# EasyEDA Pro project STM32空调遥控器.eprj, board PCB_V1.0.0
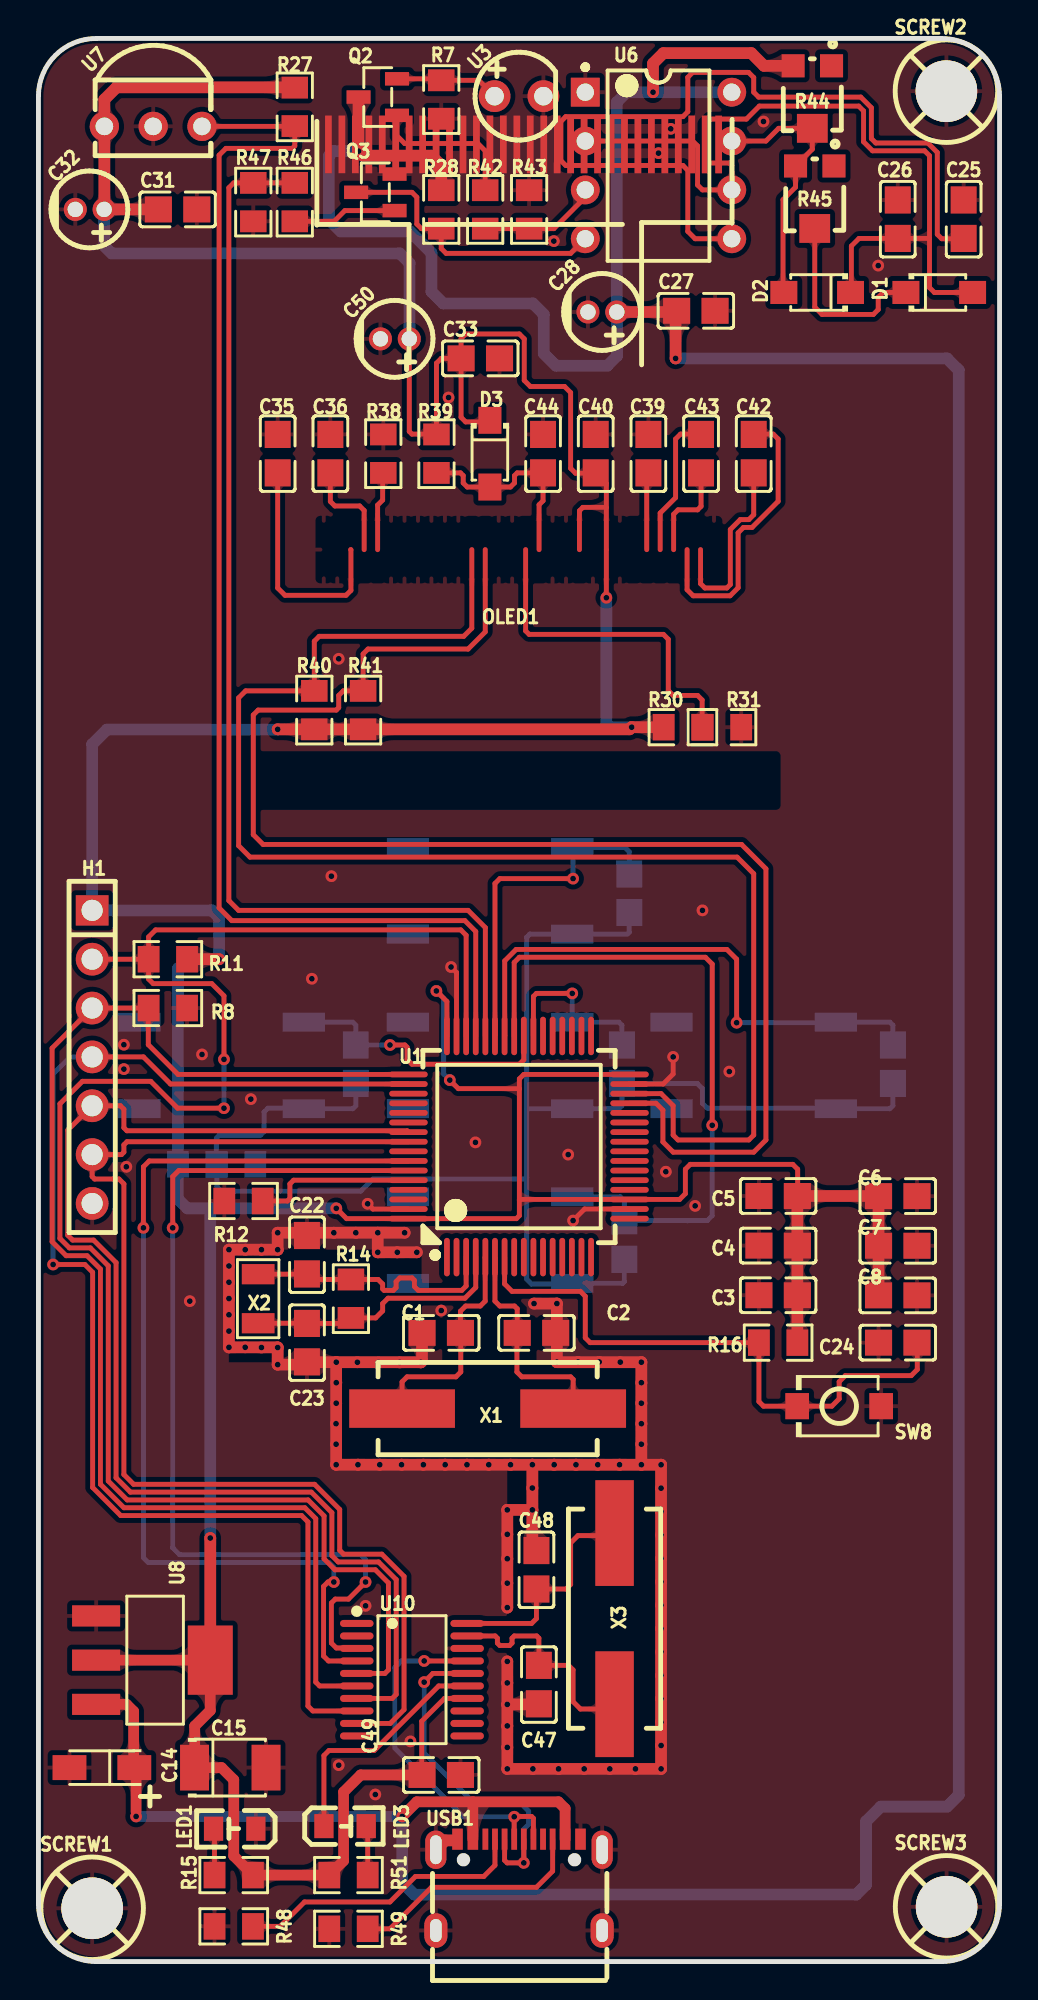
[diagram p7: board, top side]
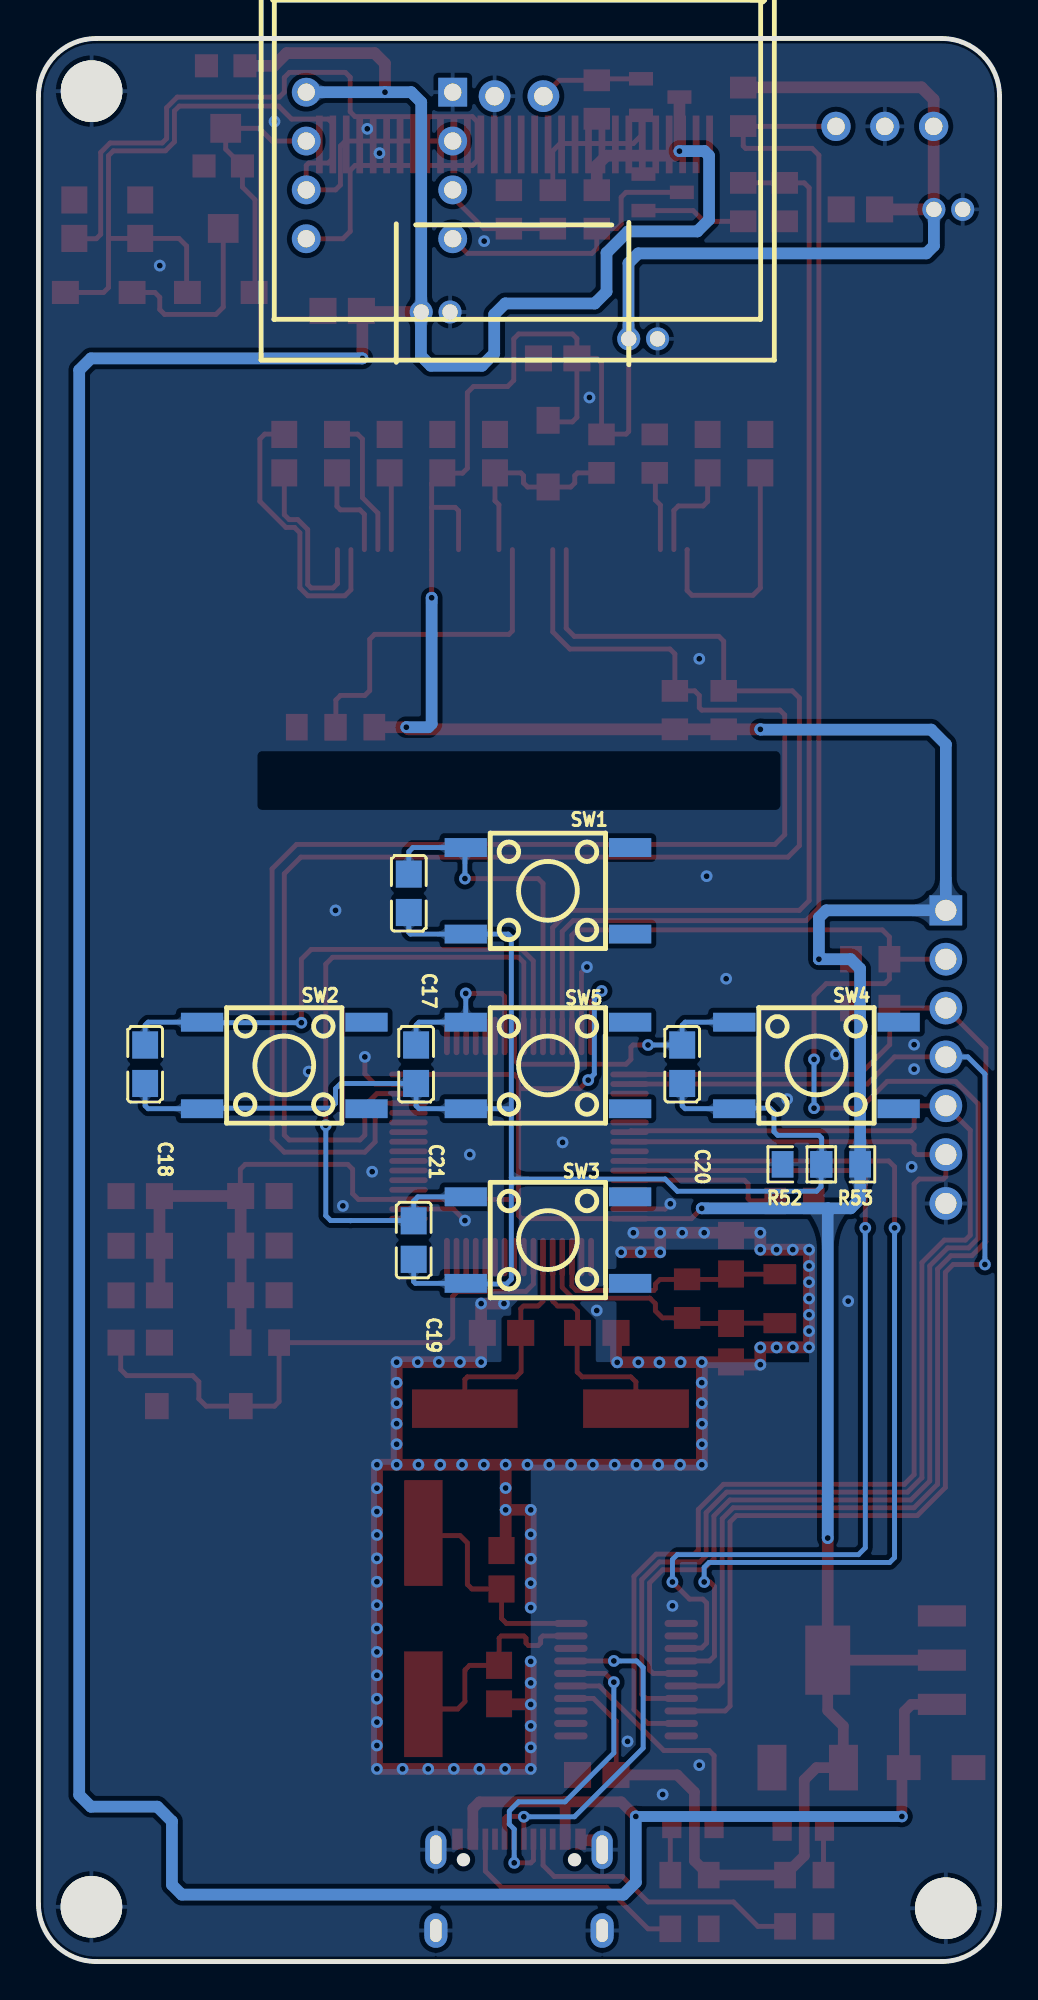
[diagram p8: board, bottom side, seen from below]

Outline 50 x 100 mm; copper layers: Top Layer, Bottom Layer. Coordinates in mm from the lower left corner of the outline.
Outline path: 0,97 0,3 arc(0.88,0.88) 3,0 47,0 arc(49.12,0.88) 50,3 50,97 arc(49.12,99.12) 47,100 3,100 arc(0.88,99.12) 0,97
Stack: Top Layer 0.035mm / Dielectric1 1.51mm FR4 er 4.5 / Bottom Layer 0.035mm

## Design rules (mm)
net OSC_IN: osc
net OSC_OUT: osc
net OSC32_IN: 32osc
net OSC32_OUT: 32osc
net XO: 347osc
net D+: usb
net D-: usb
net XI: 347osc
template: 自定义配置
spacing copperThickness1oz (default): track to track 0.152, other pairs 0.152 to 0.3
spacing copperThickness2oz: track to track 0.254, other pairs 0.152 to 0.3
track width copperThickness1oz (default): min 0.254, default 0.381, max 2.54
track width copperThickness2oz: min 0.203, default 0.254, max 2.54
differential pair differentialPair (default): width min 0.127, default 0.254, max 2.54; gap min 0.152, default 0.152
via viaSize (default): diameter min 0.5, default 0.61, max 10; hole min 0.3, default 0.305, max 6.299

## Placement (name value [footprint] x y rotation side)
C1  20pF  [C0805]  20.96 32.69 0 top
C2  20pF  [C0805]  25.91 32.69 180 top
C3  100nF  [C0805]  38.48 34.65 0 top
C4  100nF  [C0805]  38.48 37.23 0 top
C5  100nF  [C0805]  38.48 39.81 0 top
C6  100nF  [C0805]  44.7 39.8 180 top
C7  100nF  [C0805]  44.7 37.22 180 top
C8  4.7uF  [C0805]  44.7 34.64 180 top
C14  10uF  [CAP-SMD_L3.2-W1.6-RD-C7171]  3.3 10.08 180 top
C15  22uF  [CASE-B_3528]  9.98 10.08 0 top
C17  100uF  [C0805]  30.73 55.55 90 bottom
C18  100uF  [C0805]  44.45 46.66 90 bottom
C19  100uF  [C0805]  30.48 37.52 90 bottom
C20  100uF  [C0805]  16.51 46.66 90 bottom
C21  100uF  [C0805]  30.35 46.66 90 bottom
C22  12.5pF  [C0805]  13.97 36.75 270 top
C23  12.5pF  [C0805]  13.97 32.18 90 top
C24  100nF  [C0805]  44.7 32.18 0 top
C25  0.01μF  [C0805]  48.13 90.6 270 top
C26  10nF  [C0805]  44.7 90.6 270 top
C27  100nF  [C0805]  34.2 85.84 0 top
C28  10uF  [CAP-TH_BD4.0-P1.50-D0.8-FD]  29.34 85.78 180 top
C31  100nF  [C0805]  7.24 91.11 0 top
C32  10uF  [CAP-TH_BD4.0-P1.50-D0.8-FD]  2.67 91.11 180 top
C33  100nF  [C0805]  22.99 83.36 0 top
C35  2.2uF  [C0805]  12.45 78.41 270 top
C36  2.2uF  [C0805]  15.19 78.41 270 top
C39  1uF  [C0805]  31.73 78.41 270 top
C40  1uF  [C0805]  28.99 78.41 270 top
C42  10uF  [C0805]  37.21 78.41 270 top
C43  10uF  [C0805]  34.47 78.41 270 top
C44  100nF  [C0805]  26.25 78.41 270 top
C47  20pF  [C0805]  26.03 14.4 90 top
C48  20pF  [C0805]  25.91 20.37 270 top
C49  100nF  [C0805]  20.96 9.7 0 top
C50  10uF  [CAP-TH_BD4.0-P1.50-D0.8-FD]  18.54 84.38 180 top
D1  1N4007W  [SOD-123FL_L2.7-W1.8-LS3.8-RD]  46.86 86.79 0 top
D2  1N4007W  [SOD-123FL_L2.7-W1.8-LS3.8-RD]  40.51 86.79 180 top
D3  1N4004W  [SOD-123FL_L2.7-W1.8-LS3.8-RD]  23.49 78.41 270 top
H1  -  [HDR-TH_7P-P2.54-V-F]  2.79 47.04 270 top
LED1  -  [LED_0805]  10.16 6.91 180 top
LED3  -  [LED_0805]  16 7.04 0 top
OLED1  N096-2864KSWEG01-H30  [OLED_0.96-30P-P0.70-12864]  25 71.81 0 top
Q2  BSS138  [SOT-23-3_L2.9-W1.3-P1.90-LS2.4-BR]  17.65 96.95 0 top
Q3  BSS138  [SOT-23-3_L2.9-W1.3-P1.90-LS2.4-BR]  17.53 92 0 top
R7  165  [R0805]  20.96 96.83 90 top
R8  10K  [R0805]  6.73 49.58 0 top
R11  10K  [R0805]  6.73 52.12 0 top
R12  10K  [R0805]  10.67 39.55 180 top
R14  1M  [R0805]  16.26 34.47 90 top
R15  1.3K  [R0805]  10.16 4.5 0 top
R16  10K  [R0805]  38.48 32.18 0 top
R27  10K  [R0805]  13.34 96.44 90 top
R28  10K  [R0805]  20.96 91.11 90 top
R30  0  [R0805]  33.53 64.19 0 top
R31  0  [R0805]  35.56 64.19 180 top
R38  910K  [R0805]  17.94 78.41 270 top
R39  10K  [R0805]  20.71 78.41 90 top
R40  10K  [R0805]  14.35 65.08 270 top
R41  10K  [R0805]  16.89 65.08 270 top
R42  1M  [R0805]  23.24 91.11 270 top
R43  10K  [R0805]  25.53 91.11 90 top
R44  10kΩ  [RES-ADJ-SMD_3P-L3.0-W3.8-P1.75-BR]  40.26 96.95 90 top
R45  10kΩ  [RES-ADJ-SMD_3P-L3.0-W3.8-P1.75-BR]  40.39 91.75 90 top
R46  1M  [R0805]  13.34 91.49 90 top
R47  10K  [R0805]  11.18 91.49 90 top
R48  5.1K  [R0805]  10.16 1.83 0 top
R49  5.1K  [R0805]  16.13 1.7 0 top
R51  10K  [R0805]  16.13 4.5 180 top
R52  0  [R0805]  10.29 41.45 0 bottom
R53  0  [R0805]  8.25 41.45 180 bottom
SCREW1  -  [M3螺丝]  2.79 2.77 0 top
SCREW2  -  [M3螺丝]  47.24 97.26 0 top
SCREW3  -  [M3螺丝]  47.24 2.84 0 top
SW1  K2-1102SP-C4SC-04  [KEY-SMD_4P-L6.0-W6.0-P4.50-LS9.5-BL]  23.5 55.68 270 bottom
SW2  K2-1102SP-C4SC-04  [KEY-SMD_4P-L6.0-W6.0-P4.50-LS9.5-BL]  37.21 46.6 270 bottom
SW3  K2-1102SP-C4SC-04  [KEY-SMD_4P-L6.0-W6.0-P4.50-LS9.5-BL]  23.5 37.52 270 bottom
SW4  K2-1102SP-C4SC-04  [KEY-SMD_4P-L6.0-W6.0-P4.50-LS9.5-BL]  9.53 46.6 270 bottom
SW5  K2-1102SP-C4SC-04  [KEY-SMD_4P-L6.0-W6.0-P4.50-LS9.5-BL]  23.5 46.6 270 bottom
SW8  TS-1088-AR02016  [SW-SMD_L3.9-W3.0-P4.45]  41.66 28.88 180 top
U1  STM32F103RCT6  [LQFP-64_L10.0-W10.0-P0.50-LS12.0-BL]  25 42.38 0 top
U3  MHL312IR039CRT  [LED-TH_BD4.2-P2.54-FD]  25 97 0 top
U6  NE555N  [DIP-8_L9.8-W6.6-P2.54-LS7.6-BL]  32.26 93.4 270 top
U7  HS0038BD  [OPTO-TH_3P-L6.0-W5.6-P2.54_TSOP14656]  5.97 95.43 180 top
U8  AMS1117-3.3  [SOT-223-3_L6.5-W3.4-P2.30-LS7.0-BR]  5.97 15.67 180 top
U10  CH347T  [TSSOP-20_L6.5-W4.4-P0.65-LS6.4-BL]  19.43 14.66 270 top
USB1  TYPE-C 16PIN 2MD(073)  [USB-C-SMD_TYPE-C-6PIN-2MD-073]  25 3.99 0 top
X1  8MHz  [CRYSTAL-SMD_L11.5-W4.8-LS12.7]  23.37 28.75 0 top
X2  32.768kHz  [OSC-SMD_L3.2-W1.5]  11.43 34.47 90 top
X3  8MHz  [CRYSTAL-SMD_L11.5-W4.8-LS12.7]  29.97 17.83 90 top

## Footprints (pads in the part's own frame, mm; a bottom-side part is the same pattern mirrored in y, then rotated)
C0805
  rect 1.41x1.35 smd: 1(-1,0) 2(1,0)
CAP-SMD_L3.2-W1.6-RD-C7171
  rect 1.758x1.296 smd: 1(-1.687,0) 2(1.687,0)
CAP-TH_BD4.0-P1.50-D0.8-FD
  round 1.2 hole 0.8: 1(-0.75,0) 2(0.75,0)
CASE-B_3528
  rect 1.506x2.376 smd: 1(-1.861,0) 2(1.861,0)
CRYSTAL-SMD_L11.5-W4.8-LS12.7
  rect 5.5x2 smd: 1(-4.45,0) 2(4.45,0)
DIP-8_L9.8-W6.6-P2.54-LS7.6-BL
  rect 1.5x1.5 hole 0.9: 1(-3.81,-3.81)
  round 1.5 hole 0.9: 2(-1.27,-3.81) 3(1.27,-3.81) 4(3.81,-3.81) 5(3.81,3.81) 6(1.27,3.81) 7(-1.27,3.81) 8(-3.81,3.81)
HDR-TH_7P-P2.54-V-F
  rect 1.575x1.7 hole 1.1: 1(-7.62,0)
  round 1.7 hole 1.1: 2(-5.08,0) 3(-2.54,0) 4(0,0) 5(2.54,0) 6(5.08,0) 7(7.62,0)
KEY-SMD_4P-L6.0-W6.0-P4.50-LS9.5-BL
  rect 0.98x2.2 smd: 1(-2.25,-4.275) 2(-2.25,4.275) 3(2.25,-4.275) 4(2.25,4.275)
LED-TH_BD4.2-P2.54-FD
  round 1.651 hole 0.965: 1(-1.27,0) 2(1.27,0)
LED_0805
  rect 1x1.25 smd: 1(-1.15,0.005) 2(1.05,0.005)
LQFP-64_L10.0-W10.0-P0.50-LS12.0-BL
  oval 0.3x2 smd: 1(-3.75,-5.75) 2(-3.25,-5.75) 3(-2.75,-5.75) 4(-2.25,-5.75) 5(-1.75,-5.75) 6(-1.25,-5.75) 7(-0.75,-5.75) 8(-0.25,-5.75) 9(0.25,-5.75) 10(0.75,-5.75) 11(1.25,-5.75) 12(1.75,-5.75) 13(2.25,-5.75) 14(2.75,-5.75) 15(3.25,-5.75) 16(3.75,-5.75) 33(3.75,5.75) 34(3.25,5.75) 35(2.75,5.75) 36(2.25,5.75) 37(1.75,5.75) 38(1.25,5.75) 39(0.75,5.75) 40(0.25,5.75) 41(-0.25,5.75) 42(-0.75,5.75) 43(-1.25,5.75) 44(-1.75,5.75) 45(-2.25,5.75) 46(-2.75,5.75) 47(-3.25,5.75) 48(-3.75,5.75)
  oval 2x0.3 smd: 17(5.75,-3.75) 18(5.75,-3.25) 19(5.75,-2.75) 20(5.75,-2.25) 21(5.75,-1.75) 22(5.75,-1.25) 23(5.75,-0.75) 24(5.75,-0.25) 25(5.75,0.25) 26(5.75,0.75) 27(5.75,1.25) 28(5.75,1.75) 29(5.75,2.25) 30(5.75,2.75) 31(5.75,3.25) 32(5.75,3.75) 49(-5.75,3.75) 50(-5.75,3.25) 51(-5.75,2.75) 52(-5.75,2.25) 53(-5.75,1.75) 54(-5.75,1.25) 55(-5.75,0.75) 56(-5.75,0.25) 57(-5.75,-0.25) 58(-5.75,-0.75) 59(-5.75,-1.25) 60(-5.75,-1.75) 61(-5.75,-2.25) 62(-5.75,-2.75) 63(-5.75,-3.25) 64(-5.75,-3.75)
M3螺丝
  round 3.2 hole 3.2: 1(0,0)
OLED_0.96-30P-P0.70-12864
  rect 0.35x3 smd: 1(10.386,22.682) 2(9.687,22.684) 3(8.986,22.684) 4(8.287,22.684) 5(7.587,22.684) 6(6.886,22.684) 7(6.186,22.684) 8(5.487,22.684) 9(4.787,22.684) 10(4.086,22.684) 11(3.386,22.684) 12(2.687,22.684) 13(1.986,22.684) 14(1.286,22.684) 15(0.587,22.684) 16(-0.114,22.684) 17(-0.814,22.684) 18(-1.514,22.684) 19(-2.213,22.684) 20(-2.913,22.684) 21(-3.614,22.684) 22(-4.314,22.684) 23(-5.013,22.684) 24(-5.713,22.684) 25(-6.413,22.684) 26(-7.114,22.684) 27(-7.814,22.684) 28(-8.514,22.686) 29(-9.213,22.686) 30(-9.914,22.686)
OPTO-TH_3P-L6.0-W5.6-P2.54_TSOP14656
  round 1.524 hole 0.914: 1(-2.54,0) 2(0,0) 3(2.54,0)
OSC-SMD_L3.2-W1.5
  rect 1.05x1.7 smd: 1(-1.275,0) 2(1.275,0)
R0805
  rect 1.133x1.377 smd: 1(-1,0) 2(1,0)
RES-ADJ-SMD_3P-L3.0-W3.8-P1.75-BR
  rect 1.2x1.2 smd: 1(1.625,-1) 3(1.625,1)
  rect 1.5x1.6 smd: 2(-1.625,0)
SOD-123FL_L2.7-W1.8-LS3.8-RD
  rect 1.4x1.2 smd: 1(-1.735,0) 2(1.735,0)
SOT-23-3_L2.9-W1.3-P1.90-LS2.4-BR
  rect 1.25x0.7 smd: 1(1,-0.95) 2(1,0.95) 3(-1,0)
SOT-223-3_L6.5-W3.4-P2.30-LS7.0-BR
  rect 2.5x1.1 smd: 1(2.97,-2.3) 2(2.97,0) 3(2.97,2.3)
  rect 2.34x3.6 smd: 4(-2.97,0)
SW-SMD_L3.9-W3.0-P4.45
  rect 1.23x1.36 smd: 1(-2.185,0) 2(2.185,0)
TSSOP-20_L6.5-W4.4-P0.65-LS6.4-BL
  oval 0.364x1.742 smd: 1(-2.925,-2.871) 2(-2.275,-2.871) 3(-1.625,-2.871) 4(-0.975,-2.871) 5(-0.325,-2.871) 6(0.325,-2.871) 7(0.975,-2.871) 8(1.625,-2.871) 9(2.275,-2.871) 10(2.925,-2.871) 11(2.925,2.871) 12(2.275,2.871) 13(1.625,2.871) 14(0.975,2.871) 15(0.325,2.871) 16(-0.325,2.871) 17(-0.975,2.871) 18(-1.625,2.871) 19(-2.275,2.871) 20(-2.925,2.871)
USB-C-SMD_TYPE-C-6PIN-2MD-073
  rect 0.55x1.1 smd: 1(-3.2,2.375) 2(-2.4,2.375) 11(2.4,2.375) 12(3.2,2.375)
  rect 0.3x1.1 smd: 3(-1.75,2.375) 4(-1.25,2.375) 5(-0.75,2.375) 6(-0.25,2.375) 7(0.25,2.375) 8(0.75,2.375) 9(1.25,2.375) 10(1.75,2.375)
  oval 1.1x2 hole 0.6x1.5: 13(-4.325,1.825) 14(4.325,1.825)
  oval 1.2x1.8 hole 0.6x1.2: 13(-4.325,-2.375) 14(4.325,-2.375)

## Nets
+5V: C14.1 C27.1 C28.1 Q2.3 R28.2 R44.3 U6.8 U8.3 USB1.2 USB1.11
GND: C1.1 C2.1 C3.1 C4.1 C5.1 C6.1 C7.1 C8.1 C14.2 C15.2 C22.1 C23.1 C24.1 C25.1 C26.1 C27.2 C28.2 C31.2 C32.2 C33.2 C35.1 C36.1 C39.1 C40.1 C44.1 C47.1 C48.1 C49.2 C50.2 H1.7 LED1.1 OLED1.1 OLED1.8 OLED1.10 OLED1.12 OLED1.13 OLED1.16 OLED1.17 OLED1.20 OLED1.21 OLED1.22 OLED1.23 OLED1.24 OLED1.25 OLED1.29 OLED1.30 Q3.2 R7.1 R8.2 R12.2 R31.1 R38.1 R43.2 R47.1 R48.1 R49.1 R52.2 SCREW1.1 SCREW2.1 SCREW3.1 SW8.1 U1.18 U1.31 U1.47 U1.63 U3.2 U6.1 U7.2 U8.1 U10.18 USB1.1 USB1.12 USB1.13 USB1.14
VCC: C3.2 C4.2 C5.2 C6.2 C7.2 C8.2 C15.1 C31.1 C32.1 C33.1 C40.2 C49.1 C50.1 D3.1 H1.1 OLED1.9 OLED1.11 R11.2 R15.2 R16.2 R27.2 R30.1 R39.2 R40.2 R41.2 R51.2 R53.2 U1.19 U1.32 U1.48 U1.64 U7.3 U8.2 U8.4 U10.14
BOOT0: R12.1 U1.60
D+: U10.17 USB1.6 USB1.8
D-: U10.16 USB1.5 USB1.7
IR_CTL: R46.2 R47.2 U1.44
IR_IN: R27.1 U1.45 U7.1
IR_OUT: R42.2 R43.1 U6.3
JTDI: H1.4 U1.50 U10.8
JTDO: H1.5 U1.55 U10.7
JTRST: H1.6 U1.56 U10.9
KEY_1: C17.2 SW1.1 U1.43
KEY_2: C18.2 SW2.1 U1.42
KEY_3: C19.2 SW3.1 U1.41
KEY_4: C20.2 SW4.1 U1.40
KEY_5: C21.2 SW5.1 U1.39
NRST: C24.2 R16.1 SW8.2 U1.7
OLED_IREF: OLED1.26 R38.2
OLED_RES: C44.2 D3.2 OLED1.14 R39.1
OLED_SCL: OLED1.18 R41.1 U1.29
OLED_SDA: OLED1.19 R40.1 U1.30
OSC32_IN: C22.2 R14.2 U1.3 X2.2
OSC32_OUT: C23.2 R14.1 U1.4 X2.1
OSC_IN: C1.2 U1.5 X1.1
OSC_OUT: C2.2 U1.6 X1.2
RX: U1.59 U10.3
SWCLK: H1.3 R8.1 U1.49 U10.6
SWDIO: H1.2 R11.1 U1.46 U10.5
TX: U1.58 U10.4
XI: C47.2 U10.19 X3.1
XO: C48.2 U10.20 X3.2
$1N2657: C17.1 C18.1 C19.1 C20.1 C21.1 R52.1 R53.1 SW1.3 SW2.3 SW3.3 SW4.3 SW5.3
$1N5313: Q2.2 R7.2 U3.1
$1N6331: LED1.2 R15.1
$1N7061: Q3.3 R28.1 U6.4
$1N7750: C25.2 U6.5
$1N7809: C26.2 D1.2 D2.1 U6.2 U6.6
$1N7888: D2.2 R44.2 R45.3 U6.7
$1N9996: D1.1 R45.2
$1N16904: C35.2 OLED1.28
$1N16987: C36.2 OLED1.27
$1N17245: C39.2 OLED1.6
$1N17593: OLED1.15 R30.2 R31.2
$1N27947: C42.2 OLED1.2
$1N27951: C43.2 OLED1.4
$1N27956: C43.1 OLED1.5
$1N27972: C42.1 OLED1.3
$1N30536: Q2.1 R42.1
$1N30803: Q3.1 R46.1
$1N31898: R48.2 USB1.4
$1N31900: R49.2 USB1.10
$1N32166: LED3.2 R51.1
$1N32261: LED3.1 U10.15

Pads without a net: OLED1 7; R44 1; R45 1; SW1 2 4; SW2 2 4; SW3 2 4; SW4 2 4; SW5 2 4; U1 1 2 8 9 10 11 12 13 14 15 16 17 20 21 22 23 24 25 26 27 28 33 34 35 36 37 38 51 52 53 54 57 61 62; U10 1 2 10 11 12 13; USB1 3 9

## Via types
v1: diameter 0.61, hole 0.305, Top Layer to Bottom Layer, 148 vias

## Routing (per net, layer and track width the routed paths; a pad name or vN(x,y) marks a point on that pad's centre or on a via; arc(x,y) is an arc through that point)
+5V: length 228.1
  Top Layer w0.559: USB1.2 22.6,8.31 ; 22.6,8.31 19.69,8.31 v1(18.92,7.54) ; 22.6,8.31 27.05,8.31 27.4,7.96 USB1.11 ; 5.08,7.8 5.08,9.99 C14.1 4.95,10.12 4.95,13 4.59,13.37 U8.3
  Top Layer w0.61: R28.2 20.96,93.4 20.45,93.9 16.89,93.9 v1(16.65,94.14) Q2.3 ; 33.15,85.79 C27.1 ; 33.15,85.79 v1(33.15,83.36) ; 33.15,85.79 33.14,85.78 C28.1 ; v1(31.97,97.21) 31.97,98.7 32.51,99.24 37.08,99.24 37.75,98.58 R44.3
  Bottom Layer w0.559: v1(5.08,7.54) v1(18.92,7.54)
  Bottom Layer w0.61: v1(33.15,83.36) 47.27,83.36 47.88,82.75 47.88,8.66 47.27,8.05 43.81,8.05 43.05,7.29 43.05,3.99 42.54,3.48 19.56,3.48 18.92,4.12 v1(18.92,7.54) ; v1(16.65,94.14) 15.35,94.14 15.11,93.9 15.11,90.58 15.72,89.97 19.33,89.97 20.45,88.85 20.45,86.83 21.06,86.22 25.72,86.22 26.29,85.65 26.29,83.62 26.92,82.98 29.59,82.98 30.1,83.49 30.1,85.76 C28.1 30.09,96.69 30.61,97.21 v1(31.97,97.21) U6.8
GND: length 122.8
  Top Layer w0.254: U1.31 32.5,45.63 33.02,46.15 v1(33.02,47.04) ; U1.47 21.75,51.43 v1(21.47,51.72) ; U1.18 28.41,39.13 v1(27.81,38.53) ; U1.63 17.4,39.13 v1(17.13,39.4)
  Top Layer w0.508: 15.49,25.84 v1(15.49,25.84)
  Top Layer w0.61: 21.74,6.3 21.16,6.3 USB1.13 ; v1(25.69,25.84) v1(25.69,24.62) v1(25.69,23.49) ; v1(25.69,25.84) v1(26.83,25.84) v1(27.96,25.84) v1(29.1,25.84) v1(30.23,25.84) v1(31.37,25.84) ; v1(25.69,25.84) v1(24.56,25.84) v1(23.43,25.84) v1(22.29,25.84) v1(21.16,25.84) v1(20.02,25.84) v1(18.89,25.84) v1(17.76,25.84) v1(16.62,25.84) v1(15.49,25.84) 15.49,31.16 v1(15.49,31.17) ; v1(25.69,23.49) 25.69,21.58 C48.1 ; v1(25.69,23.49) v1(24.39,23.49) v1(24.39,22.22) v1(24.39,20.95) v1(24.39,19.68) v1(24.39,18.41) ; v1(24.39,13.37) v1(24.39,14.49) v1(24.39,15.61) ; v1(24.39,13.37) 26,13.37 C47.1 ; v1(24.39,13.37) v1(24.39,12.25) v1(24.39,11.13) v1(24.39,10.02) v1(25.72,10.02) v1(27.06,10.02) v1(28.39,10.02) v1(29.72,10.02) v1(31.06,10.02) v1(32.39,10.02) v1(32.39,11.23) v1(32.39,12.45) v1(32.39,13.67) v1(32.39,14.88) v1(32.39,16.1) v1(32.39,17.32) v1(32.39,18.53) v1(32.39,19.75) v1(32.39,20.97) v1(32.39,22.18) v1(32.39,23.4) v1(32.39,24.62) v1(32.39,25.83) 32.39,25.84 v1(31.37,25.84) ; v1(15.49,31.17) 13.99,31.17 C23.1 13.83,31.04 v1(12.45,31.04) v1(12.45,31.93) 12.44,31.94 v1(9.91,31.94) v1(9.91,32.78) v1(9.91,33.63) v1(9.91,34.48) v1(9.91,35.32) v1(9.91,36.17) v1(9.91,37.02) v1(10.76,37.02) v1(11.6,37.02) v1(12.45,37.02) v1(12.45,37.9) 13.83,37.9 C22.1 14.11,37.9 v1(15.37,37.9) v1(16.51,37.9) v1(17.65,37.9) ; v1(15.49,31.17) 19.89,31.17 v1(19.89,31.16) 19.96,31.22 C1.1 ; v1(17.65,37.9) v1(17.65,36.88) v1(18.67,36.88) v1(19.69,36.88) ; v1(17.65,37.9) v1(19.05,37.9) ; v1(31.37,25.84) v1(31.37,26.9) v1(31.37,27.97) v1(31.37,29.03) v1(31.37,30.1) v1(31.37,31.17) 26.98,31.17 v1(26.97,31.17) 26.97,32.63 C2.1 26.97,32.75 v1(26.97,34.21) v1(25.78,34.21)
  vias: v1(4.44,47.68) v1(4.44,46.41) v1(4.57,41.33) v1(7.87,34.34) v1(8.51,47.17) v1(10.76,31.94) v1(11.05,44.85) v1(11.6,31.93) v1(14.22,51.11) v1(15.24,56.44) v1(15.49,30.1) v1(15.49,29.03) v1(15.48,27.97) v1(15.48,26.9) v1(15.62,67.74) v1(15.62,10.21) v1(16.59,31.16) v1(17.02,18.5) v1(17.53,8.69) v1(17.69,31.15) v1(18.79,31.16) v1(19.35,11.45) v1(20.96,33.85) v1(21.34,81.33) v1(22.73,42.6) v1(26.81,89.46) v1(27.56,41.96) v1(28.07,31.18) v1(29.17,31.18) v1(30.27,31.17) v1(32.26,94.04) v1(32.64,41.07) v1(32.89,95.3) v1(34.16,39.29) v1(34.54,54.66) v1(35.94,46.28) v1(37.72,95.68) v1(43.69,88.19)
VCC: length 292.1
  Top Layer w0.254: v1(29.54,70.92) 29.54,75.62 ; v1(20.7,50.47) 21.25,49.92 U1.48 ; 25.02,45.39 21.84,45.39 v1(21.4,45.83) ; 25.02,45.39 25.02,45.9 25.25,46.13 U1.32 ; 25.02,45.39 25.02,39.6 ; C33.1 21.99,80.3 22.22,80.06 23.4,80.06 D3.1 ; C33.1 20.96,83.36 20.71,83.11 R39.2 20.69,79.43 19.43,79.43 19.29,79.56 C50.1 ; C33.1 21.99,84.39 22.22,84.63 25.02,84.63 25.27,84.38 25.27,82.22 25.59,81.9 27.37,81.9 27.69,81.58 27.69,77.65 27.94,77.39 28.97,77.39 C40.2 29.54,76.86 29.54,75.62 ; 25.02,39.6 25.02,38.79 24.86,38.63 U1.64 16.03,38.63 v1(15.49,39.17) ; 25.02,39.6 25.05,39.63 U1.19 33.36,39.63 33.66,39.93 33.66,41.2 33.91,41.45 39.24,41.45 39.5,41.2 39.5,39.82 C5.2 ; 29.54,75.62 28.32,75.62 28.14,75.44 28.14,73.42 ; U10.14 21.12,13.68 19.94,12.5 19.94,9.72 C49.1
  Top Layer w0.559: U8.2 U8.4 8.94,13.05 8.13,12.24 8.13,10.09 C15.1 9.53,10.08 10.16,9.45 10.16,5.5 R15.2 R51.2 15.88,5.24 15.88,8.81 16.76,9.7 C49.1
  Top Layer w0.61: C31.1 C32.1 3.43,91.12 U7.3 3.43,96.83 4.06,97.46 13.32,97.46 R27.2 ; R11.2 v1(9.4,52.12) ; R30.1 v1(30.86,64.19) 30.75,64.08 R41.2 R40.2 v1(12.45,64.08) ; C8.2 C7.2 C6.2 43.7,39.81 C5.2 C4.2 C3.2 R16.2 ; U8.4 v1(8.94,22.02)
  Bottom Layer w0.254: v1(21.4,45.83) 21.08,46.15 21.08,50.09 v1(20.7,50.47)
  Bottom Layer w0.61: v1(30.86,64.19) 29.72,64.19 29.54,64.36 v1(29.54,70.92) ; 8.94,39.17 7.75,39.17 7.25,39.66 R53.2 7.25,51.63 7.75,52.12 v1(9.4,52.12) 9.4,54.28 9.02,54.66 H1.1 2.79,63.3 3.56,64.06 12.43,64.06 v1(12.45,64.08) ; 8.94,39.17 v1(8.94,22.02) ; 8.94,39.17 v1(15.49,39.17) ; C50.1 19.3,84.39 19.3,88.32 18.8,88.82 3.81,88.82 3.42,89.22 C32.1
BOOT0: length 8.5
  Top Layer w0.254: U1.60 13.27,40.63 13.08,40.44 13.08,39.67 12.95,39.55 R12.1
D+: length 18.9
  Top Layer w0.254: USB1.6 v1(24.75,7.53) 24.76,7.54 25.65,7.54 25.75,7.45 USB1.8 ; U10.17 20.19,15.63
  Bottom Layer w0.254: v1(20.07,15.63) 18.88,15.63 18.54,15.29 18.54,11.1 22.11,7.53 v1(24.75,7.53)
D-: length 19
  Top Layer w0.254: v1(20.07,14.53) 20.52,14.98 U10.16 ; USB1.5 24.25,5.26 24.38,5.13 v1(25.25,5.13) USB1.7
  Bottom Layer w0.254: v1(20.07,14.53) 20.07,10.85 22.61,8.31 25.02,8.31 25.5,7.82 25.5,7.14 25.25,6.89 v1(25.25,5.13)
IR_CTL: length 60.2
  Top Layer w0.254: U1.44 23.25,53.76 22.35,54.66 10.41,54.66 9.91,55.17 9.91,92.24 10.16,92.49 R47.2 R46.2
IR_IN: length 68.4
  Top Layer w0.254: U1.45 22.75,53.56 22.18,54.13 10.06,54.13 9.4,54.79 9.4,93.93 9.75,94.28 13.21,94.28 13.34,94.41 R27.1 13.32,95.43 U7.1
IR_OUT: length 6.3
  Top Layer w0.254: U6.3 28.45,91.75 26.81,90.11 R43.1 R42.2
JTDI: length 66.9
  Top Layer w0.254: U1.50 6.87,45.63 5.46,47.04 H1.4 ; v1(0.76,36.25) 2.41,36.25 2.82,35.84 2.82,24.65 4.28,23.19 13.69,23.19 14.02,22.86 14.02,13.28 14.27,13.03 U10.8
  Bottom Layer w0.254: H1.4 1.65,47.04 0.76,46.15 v1(0.76,36.25)
JTDO: length 65.3
  Top Layer w0.254: U1.55 19.18,43.2 4.6,43.2 4.44,43.36 4.44,44.32 4.27,44.5 H1.5 1.52,43.23 1.52,37.77 1.78,37.52 2.87,37.52 4.04,36.34 4.04,25.16 4.78,24.41 14.2,24.41 15.27,23.34 15.27,21.11 15.6,20.78 17.69,20.78 18.61,19.86 18.61,13.89 18.4,13.68 U10.7
JTRST: length 62.7
  Top Layer w0.254: U1.56 4.61,42.63 4.44,42.47 4.44,42.09 4.32,41.96 H1.6 2.79,40.82 2.92,40.69 4.19,40.69 4.44,40.44 4.44,25.32 4.95,24.82 14.36,24.82 15.67,23.51 15.67,21.39 15.88,21.18 17.86,21.18 19.02,20.03 19.02,13.1 18.3,12.38 U10.9
KEY_1: length 17.9
  Top Layer w0.254: v1(27.81,56.31) 24,56.31 23.75,56.06 U1.43
  Bottom Layer w0.254: C17.2 30.73,57.71 30.52,57.93 SW1.1 27.81,57.88 v1(27.81,56.31)
KEY_2: length 29
  Top Layer w0.254: U1.42 24.26,48.14 24.26,52.04 24.85,52.63 35.81,52.63 36.32,52.12 v1(36.32,48.82)
  Bottom Layer w0.254: v1(36.32,48.82) 41.46,48.82 SW2.1 44.3,48.85 44.45,48.69 C18.2
KEY_3: length 36
  Top Layer w0.254: v1(35.05,43.48) 35.05,51.87 34.7,52.22 25.02,52.22 24.75,51.95 U1.41
  Bottom Layer w0.254: 33.77,38.52 33.78,38.53 ; 33.78,38.53 34.8,38.53 35.05,38.79 v1(35.05,43.48) ; 33.78,38.53 30.5,38.53 C19.2 30.48,39.55 30.26,39.77 SW3.1
KEY_4: length 14.7
  Top Layer w0.254: v1(18.29,47.66) 19.07,47.66 19.18,47.55 19.18,46.91 19.43,46.66 25.02,46.66 25.25,46.89 U1.40
  Bottom Layer w0.254: v1(18.29,47.66) C20.2 16.51,48.69 16.36,48.85 SW4.1
KEY_5: length 9.3
  Top Layer w0.254: U1.39 25.75,50.19 25.91,50.34 v1(27.77,50.34)
  Bottom Layer w0.254: C21.2 30.35,48.69 30.2,48.85 SW5.1 v1(27.77,50.34)
NRST: length 31.3
  Top Layer w0.254: C24.2 45.72,32.17 45.72,30.78 45.4,30.47 41.97,30.47 41.66,30.15 41.66,29.26 41.28,28.88 SW8.2 37.72,28.88 37.48,29.12 R16.1 28.7,32.18 28.45,32.44 28.45,34.59 28.19,34.85 24.64,34.85 24.25,35.24 U1.7
OLED_IREF: length 4.1
  Top Layer w0.254: 17.64,73.42 17.64,75.73 17.91,76 17.91,77.38 R38.2
OLED_RES: length 10.7
  Top Layer w0.254: 26.04,73.42 26.04,75.75 26.25,75.96 C44.2 24.91,77.41 24.76,77.27 24.76,76.89 24.55,76.67 D3.2 22.31,76.67 22.1,76.89 22.1,77.27 21.96,77.41 R39.1
OLED_SCL: length 76.7
  Top Layer w0.254: 23.24,73.42 23.24,69.14 22.35,68.25 17.15,68.25 16.89,68 R41.1 15.86,66.08 15.62,65.84 15.62,65.2 15.49,65.08 11.43,65.08 11.18,64.82 11.18,58.6 11.68,58.09 36.58,58.09 37.85,56.82 37.85,42.72 37.21,42.09 33.02,42.09 32.49,42.62 32.49,44.27 32.13,44.63 U1.29
OLED_SDA: length 76.4
  Top Layer w0.254: U1.30 32.39,45.13 33.02,44.5 33.02,42.98 33.27,42.72 36.96,42.72 37.21,42.98 37.21,56.57 36.35,57.43 11.01,57.43 10.41,58.02 10.41,65.71 10.78,66.08 R40.1 14.35,68.66 14.6,68.91 22.12,68.91 22.54,69.33 22.54,73.42
OSC32_IN: length 13.8
  Top Layer w0.254: X2.2 13.96,35.74 C22.2 14.26,35.47 R14.2 17.67,35.47 17.91,35.23 17.91,34.98 17.98,34.9 18.47,34.9 18.61,35.04 18.61,35.36 18.8,35.55 19.43,35.55 19.56,35.42 19.56,35.1 19.76,34.9 22.02,34.9 22.25,35.13 U1.3
OSC32_OUT: length 13.9
  Top Layer w0.254: X2.1 13.96,33.19 C23.2 15.97,33.18 R14.1 17.54,33.47 17.91,33.83 17.91,34.21 18.19,34.49 22.19,34.49 22.75,35.05 U1.4
OSC_IN: length 11.6
  Top Layer w0.254: U1.5 23.24,36.62 23.24,34.34 22.99,34.09 22.22,34.09 21.96,33.82 C1.2 21.97,32.67 21.97,30.66 21.72,30.4 19.18,30.4 18.92,30.15 X1.1
OSC_OUT: length 11.5
  Top Layer w0.254: 23.75,36.63 23.75,34.34 24,34.09 24.76,34.09 24.91,33.94 C2.2 24.89,32.67 24.89,30.66 25.15,30.4 27.69,30.4 27.82,30.27 X1.2
RX: length 48.9
  Top Layer w0.254: v1(6.98,38.15) 6.98,40.82 7.3,41.13 U1.59 ; v1(17.02,19.74) 16.13,18.85 15.44,18.85 15.24,18.64 15.24,16.56 15.49,16.31 16.53,16.31 U10.3
  Bottom Layer w0.254: v1(6.98,38.15) 6.98,21.51 7.34,21.16 16.76,21.16 17.02,20.9 v1(17.02,19.74)
SWCLK: length 69
  Top Layer w0.254: U1.49 7.26,46.13 5.72,47.68 5.72,49.56 R8.1 H1.3 0.71,47.5 0.71,37.43 1.44,36.7 2.53,36.7 3.23,36.01 3.23,24.82 4.45,23.6 13.86,23.6 14.43,23.03 14.43,14.53 14.63,14.33 U10.6
SWDIO: length 92.5
  Top Layer w0.254: U1.46 22.25,53.37 21.97,53.64 6.1,53.64 5.73,53.28 R11.1 ; v1(9.65,44.37) 7.24,44.37 5.84,45.77 2.29,45.77 1.12,44.6 1.12,37.6 1.61,37.11 2.7,37.11 3.63,36.18 3.63,24.99 4.62,24 14.03,24 14.86,23.17 14.86,20.94 15.43,20.37 17.53,20.37 18.21,19.69 18.21,15.16 18.02,14.98 U10.5 ; v1(9.65,46.91) 9.65,50.22 9.02,50.85 5.97,50.85 5.73,51.09 R11.1 ; R11.1 H1.2
  Bottom Layer w0.254: v1(9.65,44.37) v1(9.65,46.91)
TX: length 51.2
  Top Layer w0.254: U10.4 15.09,15.63 14.83,15.88 14.83,19.51 15.06,19.74 v1(15.37,19.74) ; U1.58 5.77,41.63 5.46,41.33 v1(5.46,38.15)
  Bottom Layer w0.254: v1(5.46,38.15) 5.46,21.01 5.72,20.75 15.11,20.75 15.37,20.5 v1(15.37,19.74)
XI: length 11.9
  Top Layer w0.254: U10.19 23.76,16.93 23.88,16.81 23.88,16.56 24,16.43 24.51,16.43 24.64,16.56 24.64,16.81 24.75,16.93 25.92,16.93 26.03,16.81 C47.2 27.57,15.4 27.81,15.16 27.81,13.51 28.19,13.13 29.72,13.13 X3.1
XO: length 11.8
  Top Layer w0.254: X3.2 29.84,22.15 28.07,22.15 27.69,21.77 27.69,19.61 27.45,19.37 C48.2 25.91,17.84 25.65,17.58 22.3,17.58
$1N2657: length 81.9
  Bottom Layer w0.254: 25.4,40.77 25.32,40.69 17.4,40.69 16.76,40.06 9.53,40.06 9.29,40.29 R52.1 ; 25.4,40.77 25.4,44.33 ; 25.4,40.77 25.4,35.48 25.65,35.23 27.73,35.23 SW3.3 30.39,35.27 30.48,35.36 C19.1 ; C18.1 44.45,44.5 44.3,44.35 SW2.3 41.46,44.37 34.8,44.37 34.54,44.63 34.54,45.39 34.27,45.66 C21.1 30.35,44.5 30.2,44.35 SW5.3 25.42,44.35 25.4,44.33 ; 25.4,44.33 25.4,53.26 25.56,53.43 SW1.3 30.64,53.43 30.73,53.52 C17.1 ; R53.1 9.25,42.82 9.4,42.96 11.54,42.96 11.74,43.16 11.74,44.17 11.94,44.37 13.77,44.37 SW4.3 16.36,44.35 16.51,44.5 C20.1
$1N5313: length 5.5
  Top Layer w0.254: U3.1 22.91,97.83 R7.2 20.88,97.9 Q2.2
$1N6331: length 2.4
  Top Layer w0.254: R15.1 9.16,6.85 LED1.2
$1N7061: length 15
  Top Layer w0.254: U6.4 27.69,88.82 21.21,88.82 20.96,89.08 R28.1 19.92,90.11 19.69,90.35 19.69,91.75 19.43,92 Q3.3
$1N7750: length 45
  Top Layer w0.254: U6.5 34.16,89.59 33.78,89.97 33.78,93.14 33.53,93.4 27.43,93.4 27.18,93.65 27.18,95.68 27.43,95.94 33.53,95.94 33.78,96.19 33.78,97.98 34.04,98.24 36.94,98.24 37.21,97.97 37.21,97.21 37.47,96.95 42.78,96.95 43.33,96.4 43.33,94.79 43.56,94.56 46.27,94.56 46.76,94.07 46.76,89.81 46.99,89.59 48.12,89.59 C25.2
$1N7809: length 44.4
  Top Layer w0.254: U6.2 34.04,94.67 34.29,94.41 34.29,92.38 34.54,92.13 U6.6 36.07,93.4 35.94,93.52 34.93,93.52 34.67,93.78 34.67,95.56 34.93,95.81 36.83,95.81 37.5,96.48 42.67,96.48 42.93,96.23 42.93,94.62 43.39,94.16 46.1,94.16 46.35,93.9 46.35,89.59 ; 46.35,89.59 46.35,87.05 46.61,86.79 D1.2 ; 46.35,89.59 46.34,89.6 C26.2 42.69,89.6 42.29,89.2 42.29,86.83 D2.1
$1N7888: length 13.6
  Top Layer w0.254: U6.7 37.85,94.67 38.51,95.33 R44.2 40.26,94.24 R45.3 39.39,92.27 38.74,91.62 38.74,86.83 D2.2
$1N9996: length 9.8
  Top Layer w0.254: R45.2 40.39,86.03 40.77,85.65 43.43,85.65 43.69,85.9 43.69,86.54 43.94,86.79 D1.1
$1N16904: length 12.2
  Top Layer w0.254: C35.2 12.45,71.42 12.83,71.04 16,71.04 16.26,71.3 16.26,73.41 16.24,73.42
$1N16987: length 5.5
  Top Layer w0.254: 16.94,73.42 16.94,75.46 16.71,75.69 15.42,75.69 15.19,75.92 C36.2
$1N17245: length 4
  Top Layer w0.254: C39.2 31.64,77.32 31.64,73.42
$1N17593: length 17.9
  Top Layer w0.254: 25.34,73.42 25.34,69.19 25.53,69.01 32.51,69.01 32.77,68.76 32.77,66.09 33.02,65.84 34.29,65.84 34.53,65.6 R30.2
$1N27947: length 10.1
  Top Layer w0.254: 34.44,73.42 34.44,71.65 34.67,71.42 35.81,71.42 35.99,71.6 35.99,74.46 36.51,74.98 36.96,74.98 37.21,75.23 C42.2
$1N27951: length 5.2
  Top Layer w0.254: C43.2 34.47,75.67 34.29,75.49 33.27,75.49 33.04,75.26 33.04,73.42
$1N27956: length 7.5
  Top Layer w0.254: C43.1 34.46,79.43 33.4,79.43 33.15,79.17 33.15,76.12 32.34,75.32 32.34,73.42
$1N27972: length 15.3
  Top Layer w0.254: 33.74,73.42 33.74,71.34 34.06,71.02 35.98,71.02 36.4,71.44 36.4,74.3 36.68,74.57 37.13,74.57 38.48,75.93 38.48,79.17 38.23,79.43 37.23,79.43 C42.1
$1N30536: length 8
  Top Layer w0.254: Q2.1 18.65,94.94 19.05,94.54 22.86,94.54 23.24,94.16 R42.1
$1N30803: length 5.4
  Top Layer w0.254: Q3.1 15.94,91.05 15.38,90.49 R46.1
$1N31898: length 15.3
  Top Layer w0.254: 23.75,6.36 23.75,5 23.17,4.43 19.61,4.43 18.29,3.1 13.84,3.1 12.57,1.83 R48.2
$1N31900: length 12.5
  Top Layer w0.254: USB1.10 26.75,4.7 25.91,3.86 20.45,3.86 18.29,1.7 R49.2
$1N32166: length 2.6
  Top Layer w0.254: R51.1 17.13,6.96 LED3.2
$1N32261: length 12.6
  Top Layer w0.254: U10.15 20.82,14.33 17.47,10.97 15.11,10.97 14.85,10.71 LED3.1

## Copper pours and planes (outline as drawn; the poured copper is in the pictures)
GND on Top Layer: 0,100 50.04,100 50.04,-0.08 0,-0.08
GND on Bottom Layer: 0,100 50.04,100 50.04,-0.08 0,-0.08

Small or netless copper shapes (teardrops, artwork), in the pictures only: 428 on Top Layer, 78 on Bottom Layer
